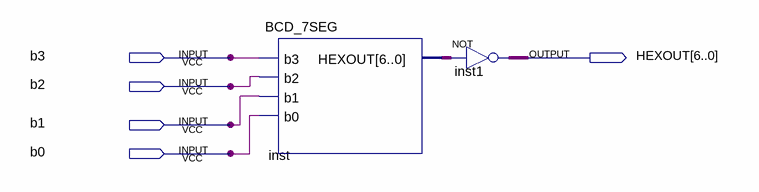
[diagram p0: schematic sheet]
// Quartus schematic Lab1.bdf as structural Verilog: 2 symbols, 5 pins
module Lab1 (
  input  b3,
  input  b2,
  input  b1,
  input  b0,
  output [6:0] HEXOUT
);

  wire [6:0] inst_hexout;

  BCD_7SEG inst (.b3(b3), .b2(b2), .b1(b1), .b0(b0), .HEXOUT(inst_hexout));
  assign HEXOUT = ~inst_hexout;  // NOT inst1, 7 bits wide
endmodule
